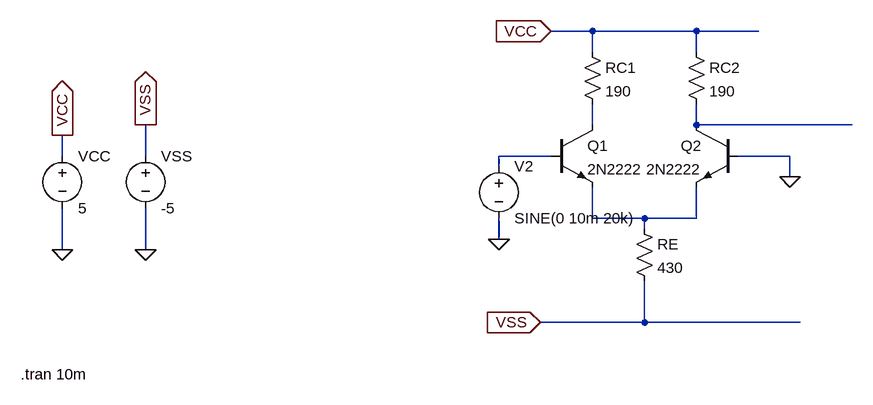
[diagram p0: schematic Pre-Amp.asc]
Pre-Amp.asc, the LTspice schematic file:
Version 4.1
SHEET 1 980 680
WIRE 128 32 64 32
WIRE 288 32 128 32
WIRE 384 32 288 32
WIRE 128 64 128 32
WIRE 288 64 288 32
WIRE 128 176 128 144
WIRE 288 176 288 144
WIRE 528 176 288 176
WIRE -688 224 -688 192
WIRE -560 224 -560 176
WIRE 64 224 -16 224
WIRE 432 224 352 224
WIRE -16 240 -16 224
WIRE 432 256 432 224
WIRE 128 320 128 272
WIRE 208 320 128 320
WIRE 288 320 288 272
WIRE 288 320 208 320
WIRE 208 336 208 320
WIRE -16 352 -16 320
WIRE -688 368 -688 304
WIRE -560 368 -560 304
WIRE 208 480 208 416
WIRE 208 480 48 480
WIRE 448 480 208 480
FLAG 64 32 VCC
IOPIN 64 32 In
FLAG 48 480 VSS
IOPIN 48 480 In
FLAG -16 352 0
FLAG -688 368 0
FLAG -560 368 0
FLAG -688 192 VCC
IOPIN -688 192 Out
FLAG -560 176 VSS
IOPIN -560 176 Out
FLAG 432 256 0
SYMBOL npn 64 176 R0
SYMATTR InstName Q1
SYMATTR Value 2N2222
SYMBOL npn 352 176 M0
SYMATTR InstName Q2
SYMATTR Value 2N2222
SYMBOL res 192 320 R0
SYMATTR InstName RE
SYMATTR Value 430
SYMBOL res 112 48 R0
SYMATTR InstName RC1
SYMATTR Value 190
SYMBOL res 272 48 R0
SYMATTR InstName RC2
SYMATTR Value 190
SYMBOL voltage -688 208 R0
SYMATTR InstName VCC
SYMATTR Value 5
SYMBOL voltage -560 208 R0
SYMATTR InstName VSS
SYMATTR Value -5
SYMBOL voltage -16 224 R0
WINDOW 123 0 0 Left 0
WINDOW 39 0 0 Left 0
SYMATTR InstName V2
SYMATTR Value SINE(0 10m 20k)
TEXT -752 560 Left 2 !.tran 10m

The netlist it stands for:
* Pre-Amp.asc
Q1 N001 N003 N004 0 2N2222
Q2 N002 0 N004 0 2N2222
RE N004 VSS 430
RC1 VCC N001 190
RC2 VCC N002 190
VCC VCC 0 5
VSS VSS 0 -5
V2 N003 0 SINE(0 10m 20k)
.model NPN NPN
.model PNP PNP
.lib standard.bjt
.tran 10m
.backanno
.end